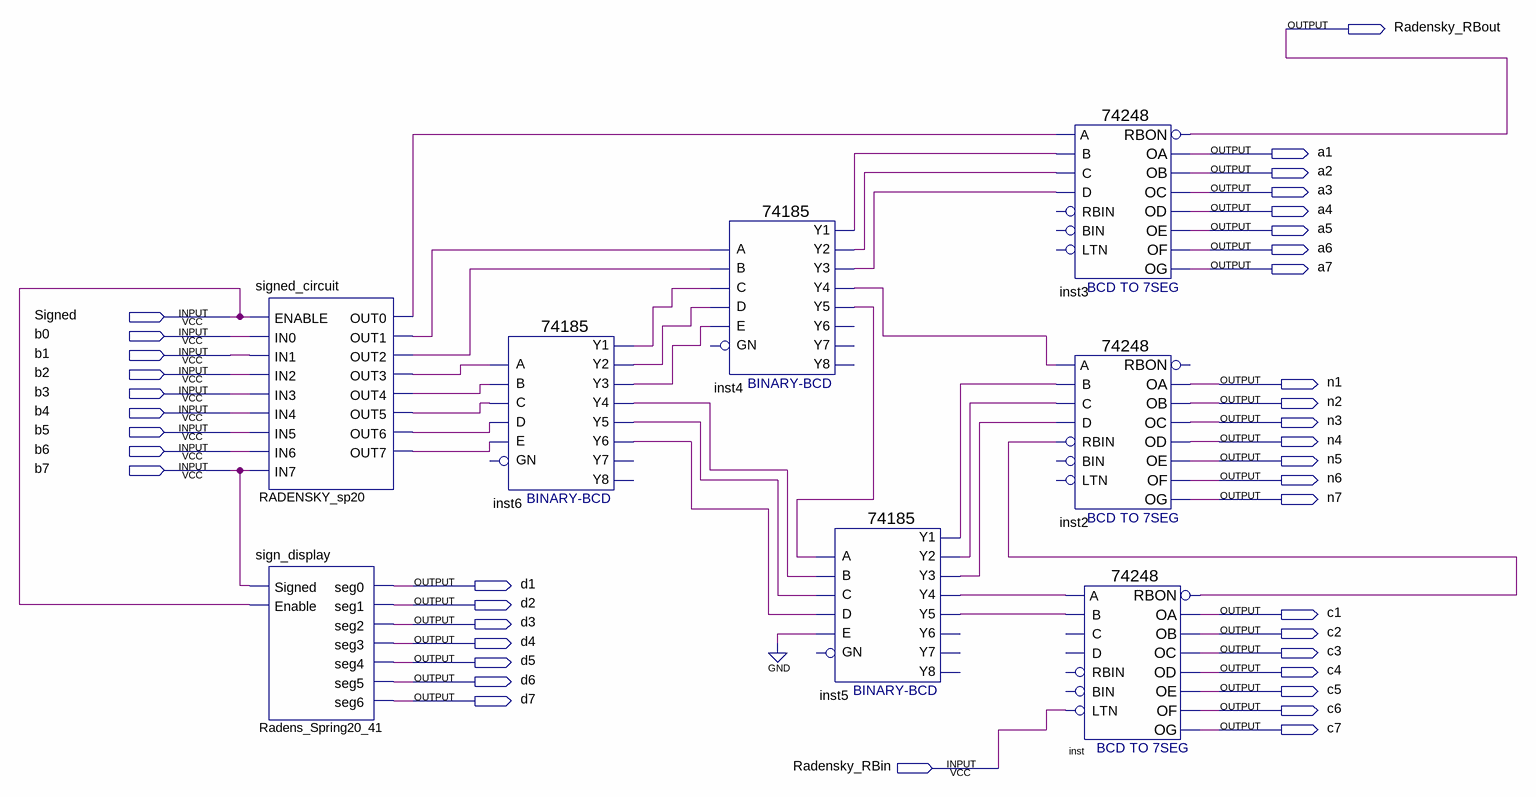
[diagram p0: schematic sheet]
// Quartus schematic withcompl.bdf as structural Verilog: 8 symbols, 39 pins
module withcompl (
  input  Signed,
  input  b0,
  input  b1,
  input  b2,
  input  b3,
  input  b4,
  input  b5,
  input  b6,
  input  b7,
  input  Radensky_RBin,
  output Radensky_RBout,
  output a1,
  output a2,
  output a3,
  output a4,
  output a5,
  output a6,
  output a7,
  output n1,
  output n2,
  output n3,
  output n4,
  output n5,
  output n6,
  output n7,
  output d1,
  output d2,
  output c1,
  output d3,
  output c2,
  output d4,
  output c3,
  output d5,
  output c4,
  output d6,
  output c5,
  output d7,
  output c6,
  output c7
);

  wire inst4_y1, inst4_y2, inst4_y3, inst4_y4, inst4_y5, inst5_y1, inst5_y2, inst5_y3, inst5_y4, inst5_y5,
       inst6_y1, inst6_y2, inst6_y3, inst6_y4, inst6_y5, inst6_y6, inst_rbon, RADENSKY_sp20_out0,
       RADENSKY_sp20_out1, RADENSKY_sp20_out2, RADENSKY_sp20_out3, RADENSKY_sp20_out4, RADENSKY_sp20_out5,
       RADENSKY_sp20_out6, RADENSKY_sp20_out7;

  signed_circuit RADENSKY_sp20 (
    .ENABLE(Signed), .IN0(b0), .IN1(b1), .IN2(b2), .IN3(b3), .IN4(b4), .IN5(b5), .IN6(b6), .IN7(b7),
    .OUT0(RADENSKY_sp20_out0), .OUT1(RADENSKY_sp20_out1), .OUT2(RADENSKY_sp20_out2),
    .OUT3(RADENSKY_sp20_out3), .OUT4(RADENSKY_sp20_out4), .OUT5(RADENSKY_sp20_out5),
    .OUT6(RADENSKY_sp20_out6), .OUT7(RADENSKY_sp20_out7));
  sign_display Radens_Spring20_41 (
    .Signed(b7), .Enable(Signed), .seg0(d1), .seg1(d2), .seg2(d3), .seg3(d4), .seg4(d5), .seg5(d6), .seg6(d7));
  \74185  inst6 (
    .A(RADENSKY_sp20_out3), .B(RADENSKY_sp20_out4), .D(RADENSKY_sp20_out6), .C(RADENSKY_sp20_out5),
    .E(RADENSKY_sp20_out7), .Y1(inst6_y1), .Y3(inst6_y3), .Y2(inst6_y2), .Y5(inst6_y5), .Y4(inst6_y4),
    .Y6(inst6_y6));  // open: GN, Y8, Y7
  \74185  inst4 (
    .A(RADENSKY_sp20_out1), .B(RADENSKY_sp20_out2), .D(inst6_y2), .C(inst6_y1), .E(inst6_y3), .Y1(inst4_y1),
    .Y3(inst4_y3), .Y2(inst4_y2), .Y5(inst4_y5), .Y4(inst4_y4));  // open: GN, Y6, Y8, Y7
  \74185  inst5 (
    .A(inst4_y5), .B(inst6_y4), .D(inst6_y6), .C(inst6_y5), .E(1'b0), .Y1(inst5_y1), .Y3(inst5_y3),
    .Y2(inst5_y2), .Y5(inst5_y5), .Y4(inst5_y4));  // open: GN, Y6, Y8, Y7
  \74248  inst3 (
    .A(RADENSKY_sp20_out0), .B(inst4_y1), .D(inst4_y3), .C(inst4_y2), .OG(a7), .OD(a4), .OE(a5), .OF(a6),
    .OA(a1), .OB(a2), .OC(a3), .RBON(Radensky_RBout));  // open: RBIN, LTN, BIN
  \74248  inst2 (
    .A(inst4_y4), .B(inst5_y1), .RBIN(inst_rbon), .D(inst5_y3), .C(inst5_y2), .OG(n7), .OD(n4), .OE(n5),
    .OF(n6), .OA(n1), .OB(n2), .OC(n3));  // open: LTN, BIN, RBON
  \74248  inst (
    .A(inst5_y4), .B(inst5_y5), .LTN(Radensky_RBin), .OG(c7), .OD(c4), .OE(c5), .OF(c6), .OA(c1), .OB(c2),
    .OC(c3), .RBON(inst_rbon));  // open: RBIN, D, C, BIN
endmodule
